# EAGLE design SNAC  7ch SMS 3D Dongle (EAGLE 9.0.1)
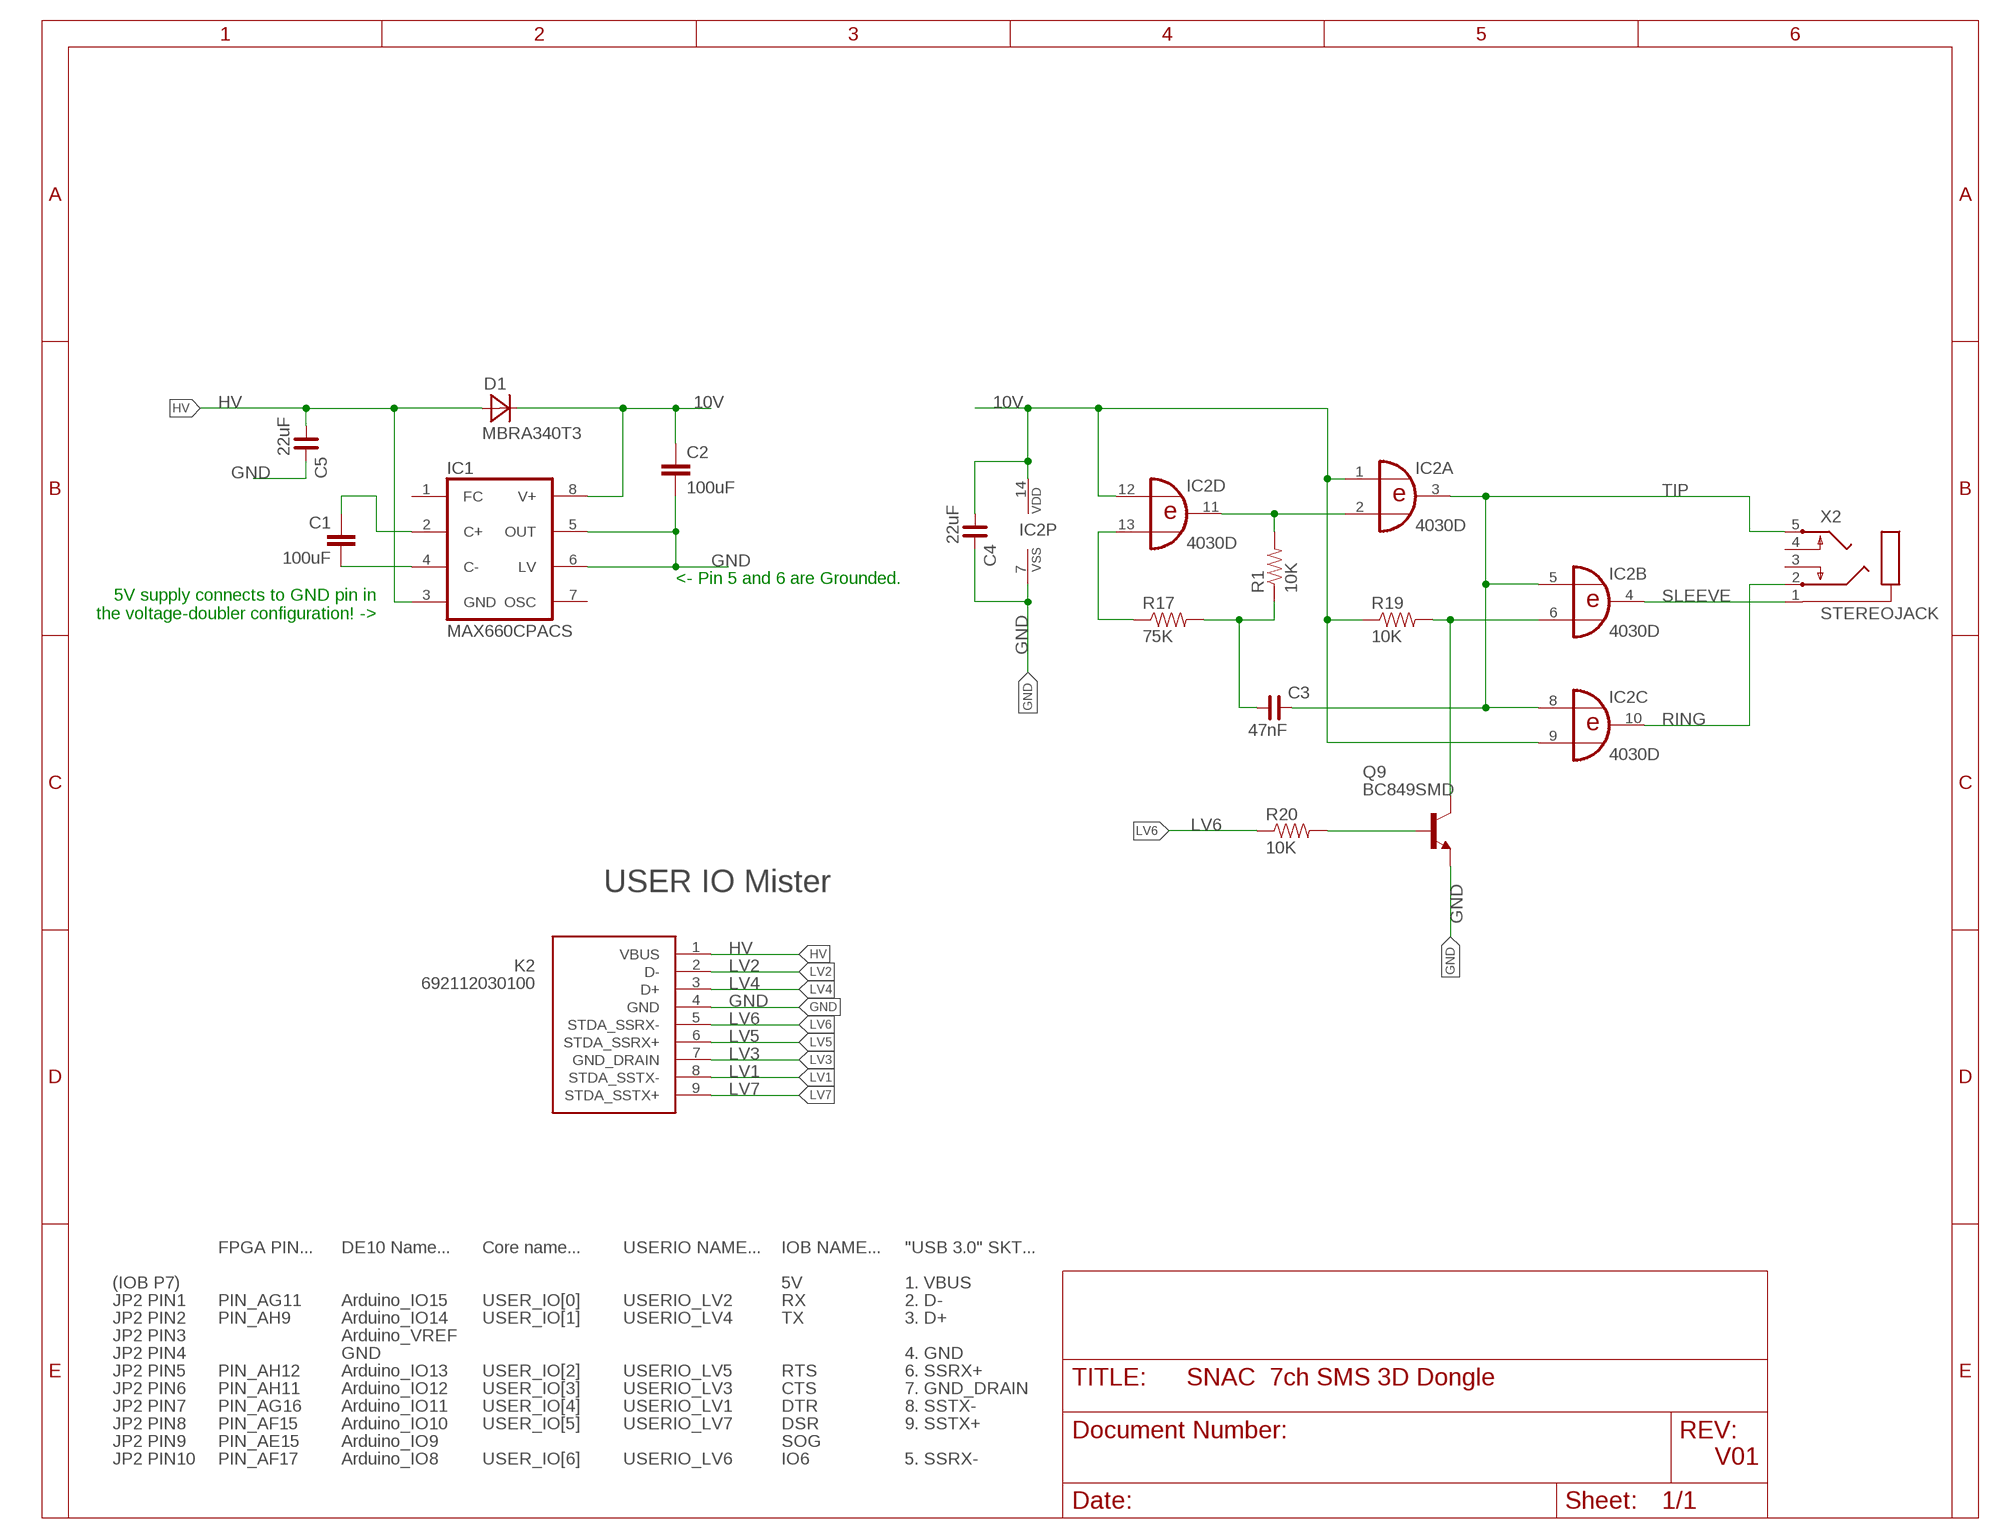
[diagram p0: schematic, sheet 1]

## Parts
C1  100uF  C-EUC1210  [C1210]
C2  100uF  C-EUC1210  [C1210]
C3  47nF  C_0805  [C0805]
C4  22uF  C_0805  [C0805]
C5  22uF  C_0805  [C0805]
D1  MBRA340T3  [SMA]
IC1  MAX660CPACS  [SO08]
IC2  4030D  [SO14]
K2  692112030100  [692112030100]
Q9  BC849SMD  [SOT23-BEC]
R1  10K  RESISTOR0603-RES  [0603-RES]
R17  75K  RESISTOR0603-RES  [0603-RES]
R19  10K  RESISTOR0603-RES  [0603-RES]
R20  10K  RESISTOR0603-RES  [0603-RES]
X2  STEREOJACK  [STX3100]

## Nets
10V: C2.1 C4.1 D1.C IC1.8(V+) IC2.1(A:I0) IC2.9(C:I1) IC2.12(D:I0) IC2.14(P:VDD) R19.1
GND: C2.2 C4.2 C5.2 IC1.5(OUT) IC1.6(LV) IC2.7(P:VSS) K2.4(GND) Q9.E
HV: C5.1 D1.A IC1.3(GND) K2.1(VBUS)
LV1: K2.8(STDA_SSTX-)
LV2: K2.2(D-)
LV3: K2.7(GND_DRAIN)
LV4: K2.3(D+)
LV5: K2.6(STDA_SSRX+)
LV6: K2.5(STDA_SSRX-) R20.1
LV7: K2.9(STDA_SSTX+)
N$5: C3.1 R1.1 R17.2
N$6: IC2.2(A:I1) IC2.11(D:O) R1.2
N$10: IC2.13(D:I1) R17.1
N$13: IC2.6(B:I1) Q9.C R19.2
N$14: Q9.B R20.2
N$25: C1.1 IC1.2(C+)
N$26: C1.2 IC1.4(C-)
RING: IC2.10(C:O) X2.2
SLEEVE: IC2.4(B:O) X2.1
TIP: C3.2 IC2.3(A:O) IC2.5(B:I0) IC2.8(C:I0) X2.5
Unconnected: IC1.1(FC) IC1.7(OSC) X2.3 X2.4

## Notes on the sheet
- <- Pin 5 and 6 are Grounded.
- 5V supply connects to GND pin in
  the voltage-doubler configuration! ->
- USER IO Mister
- FPGA PIN... | DE10 Name... | Core name... | USERIO NAME... | IOB NAME... | "USB 3.0" SKT...
- (IOB P7) | 5V | 1. VBUS
- JP2 PIN1 | PIN_AG11 | Arduino_IO15 | USER_IO[0] | USERIO_LV2 | RX | 2. D-
- JP2 PIN2 | PIN_AH9 | Arduino_IO14 | USER_IO[1] | USERIO_LV4 | TX | 3. D+
- JP2 PIN3 | Arduino_VREF
- JP2 PIN4 | GND | 4. GND
- JP2 PIN5 | PIN_AH12 | Arduino_IO13 | USER_IO[2] | USERIO_LV5 | RTS | 6. SSRX+
- JP2 PIN6 | PIN_AH11 | Arduino_IO12 | USER_IO[3] | USERIO_LV3 | CTS | 7. GND_DRAIN
- JP2 PIN7 | PIN_AG16 | Arduino_IO11 | USER_IO[4] | USERIO_LV1 | DTR | 8. SSTX-
- JP2 PIN8 | PIN_AF15 | Arduino_IO10 | USER_IO[5] | USERIO_LV7 | DSR | 9. SSTX+
- JP2 PIN9 | PIN_AE15 | Arduino_IO9 | SOG
- JP2 PIN10 | PIN_AF17 | Arduino_IO8 | USER_IO[6] | USERIO_LV6 | IO6 | 5. SSRX- | V01

## Library data of the parts
C1 C2 = rcl:C-EU: CAPACITOR, European symbol; SPICEPREFIX: C
C3-C5 = rc-master-smd:C_: NON-POLARIZED CAP
D1 = diode:MBRA340T3: Surface Mount Schottky Power Rectifier Source: http://www.onsemi.com/pub_link/Collateral/MBRA340T3-D.PDF
IC1 = maxim:MAX660CPA: Charge-pump VOLTAGE CONVERTER
IC2 = 40xx:4030: Quad XOR
K2 = Wuerth_Elektronik_eiCan_Communication_Connectors_STENCIL:692112030100: WR-COM USB 3.0 SMT PLUG WITH CLIPTYPE A
Q9 = transistor-npn:BC849*: NPN Transistor
R1 R17 R19 R20 = SparkFun:RESISTOR: Resistor Basic schematic elements and footprints for 0603, 1206, and PTH 1/10th watt (small) resistors.
X2 = adafruit:STEREOJACK: MIC/HEADPHONE JACK Stereo jack with two switches. Kycon STX3100, CUI SJ1-3555NG and/or 4UCon 05544

## Board
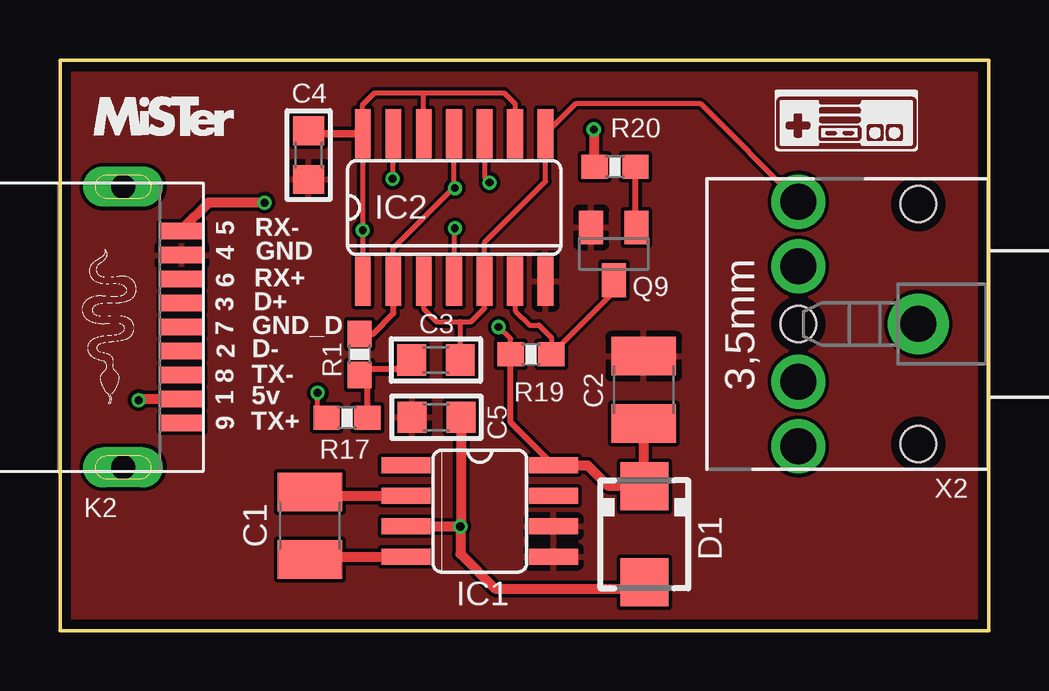
[diagram p1: board, top side]
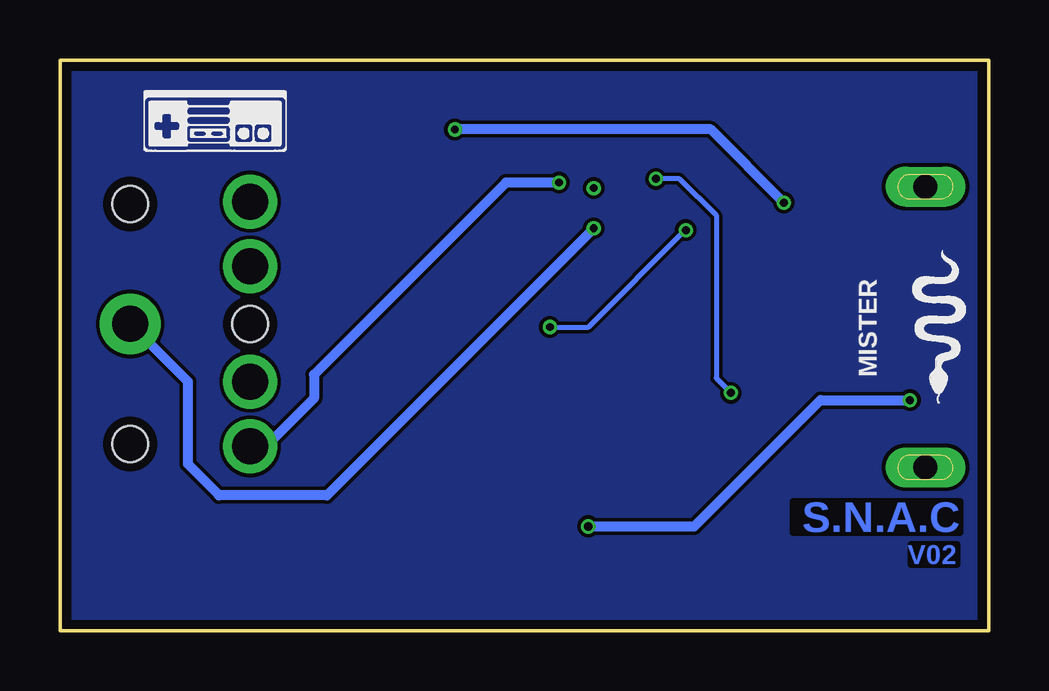
[diagram p2: board, bottom side, seen from below]

Size 38.71 x 23.77 mm. Coordinates in mm from the lower left corner, seen from the top.
Outline: 0,23.77 38.71,23.77 38.71,0 0,0 0,23.77
Copper layers (1*16): Top 0.035mm / dielectric 1.5mm / Bottom 0.035mm
Design rules "oshpark-2layer *": minimum track width 6mil, minimum drill 10mil, track to track 6mil, track to pad 6mil, pad to pad 6mil, via to via 6mil, smd to smd 6mil, copper to edge 15mil, drill to drill 6mil, minimum pad ring 5mil, minimum via ring 5mil, stop-mask expansion 2.5mil, vias tented up to drill 0mil, thermal gap 10mil

### Footprints (pad centres in the part's own frame; a part is rotated, then mirrored left to right if it is on the bottom)
C1210 = smd 1.6 x 2.7: 1 -1.4,0; 2 1.4,0
C0805 = smd 1.2 x 1.3: 1 -1.016,0; 2 1.016,0
SMA = smd 2 x 2: A 2,0; C -2,0
SO08 = smd 0.66 x 2.032: 1 -1.905,-3.073; 2 -0.635,-3.073; 3 0.635,-3.073; 4 1.905,-3.073; 5 1.905,3.073; 6 0.635,3.073; 7 -0.635,3.073; 8 -1.905,3.073
SO14 = smd 0.66 x 2.032: 1 -3.81,-3.073; 2 -2.54,-3.073; 3 -1.27,-3.073; 4 0,-3.073; 5 1.27,-3.073; 6 2.54,-3.073; 7 3.81,-3.073; 8 3.81,3.073; 9 2.54,3.073; 10 1.27,3.073; 11 0,3.073; 12 -1.27,3.073; 13 -2.54,3.073; 14 -3.81,3.073
692112030100 = smd 0.7 x 1.8: 1 -3,0; 2 -1,0; 3 1,0; 4 3,0; 5 4,0; 6 2,0; 7 0,0; 8 -2,0; 9 -4,0 | drill 1 pad 1.676 long: Z1 5.85,2.45; Z2 -5.85,2.45
SOT23-BEC = smd 1 x 1.4: B -0.95,-1.1; C 0,1.1; E 0.95,-1.1
0603-RES = smd 1.1 x 1: 1 -0.85,0; 2 0.85,0
STX3100 = drill 1.5 pad 2.54: 1 2.7,-0.1 | drill 1.5: 2 7.7,5; 3 7.7,2.3; 4 7.7,-2.5; 5 7.7,-5.2 | hole 1.5: 2.7,4.9; 2.7,-5.1; 7.7,-0.1

### Placement (x,y rotation side)
C1  10.41,4.37 270 top
C2  24.33,10.03 90 top
C3  15.67,11.28 0 top
C4  10.36,19.81 270 top
C5  15.7,8.89 180 top
D1  24.36,4.01 270 top
IC1  17.5,4.98 270 top
IC2  16.43,17.63 0 top
K2  5.08,12.65 90 top
Q9  23.09,15.7 180 top
R1  12.5,11.51 90 top
R17  11.96,8.86 0 top
R19  19.63,11.51 0 top
R20  23.14,19.33 0 top
X2  38.48,12.67 180 top

### Tracks (layer width: path | path; a pad name or v marks a point on that pad's centre or on a via)
10V  (via drill 0.33)
  Top 0.203: IC2.1 12.52,14.66 12.62,14.76 v12.62,16.69 IC2.14 12.62,21.92 13.11,22.4 15.16,22.4 | IC2.12 15.16,22.4 | 15.16,22.4 18.52,22.4 18.97,21.95 IC2.9 | R19.1 18.78,12.15 v18.29,12.65
  Top 0.254: IC1.8 18.78,8.67 R19.1
  Top 0.305: C4.1 10.49,20.7 IC2.14
  Top 0.406: C2.1 24.33,6.04 | 24.33,6.04 D1.C | IC1.8 22,6.88 22.84,6.04 24.33,6.04
  Bottom 0.203: v18.29,12.65 16.69,12.65 12.65,16.69 v12.62,16.69
GND
  Top 0.203: 22.14,16.45 Q9.E 22.16,16.97
  pour Top: 0,23.77 38.71,23.77 38.71,0 0,0
HV  (via drill 0.33, 0.35)
  Top 0.406: K2.1 3.32,9.65 v3.28,9.6 | IC1.3 v16.69,4.34 | C5.1 16.71,4.37 v16.69,4.34 | v16.69,4.34 16.69,3.2 18.14,1.75 24.1,1.75 D1.A
  Bottom 0.406: v16.69,4.34 12.27,4.34 7.01,9.6 v3.28,9.6
LV4
  Top 0.178: 5.08,13.67 K2.3
LV6  (via drill 0.33)
  Top 0.178: 5.08,16.71 K2.5
  Top 0.406: v8.53,17.83 6.2,17.83 5.08,16.71 | R20.1 22.29,20.84 v22.25,20.88
  Bottom 0.406: v8.53,17.83 11.58,20.88 v22.25,20.88
N$5
  Top 0.254: C3.1 14.27,10.9 12.74,10.9 R1.1 12.81,10.34 R17.2
N$6  (via drill 0.33)
  Top 0.203: 16.46,20.68 IC2.11 16.43,18.47 | v16.46,18.44 16.43,18.47 | IC2.2 13.89,15.93 16.43,18.47
  Top 0.254: IC2.2 13.89,13.21 13.04,12.36 R1.2
N$10  (via drill 0.33)
  Top 0.203: v13.87,18.82 13.89,18.85 IC2.13 | R17.1 10.74,9.23 v10.74,9.91
  Bottom 0.203: v13.87,18.82 12.88,18.82 11.35,17.3 11.35,10.52 v10.74,9.91
N$13
  Top 0.203: 18.97,13.64 IC2.6 18.97,13.33 19.58,12.73 19.96,12.73 20.48,12.21 R19.2 23.09,14.11 Q9.C
N$14
  Top 0.203: Q9.B 24.07,16.98
  Top 0.254: Q9.B 23.99,16.85 R20.2
N$15
  pour Bottom: 0,23.77 38.71,23.77 38.71,0 0,0
N$25
  Top 0.406: C1.1 11.12,5.61 IC1.2
N$26
  Top 0.406: C1.2 11.07,3.07 IC1.4
RING  (via drill 0.33)
  Top 0.203: IC2.10 17.7,18.87 v17.91,18.67
  Bottom 0.406: v17.91,18.67 20.12,18.67 28.12,10.67 28.12,9.68 30.12,7.67 X2.2
SLEEVE  (via drill 0.33)
  Top 0.203: v16.46,16.76 16.43,16.74 IC2.4
  Bottom 0.406: v16.46,16.76 27.58,5.64 32.08,5.64 33.38,6.93 33.38,10.37 X2.1
TIP
  Top 0.203: IC2.3 15.16,13.41 15.7,12.88 16.69,12.88 | 16.69,12.88 17.14,12.88 17.7,13.44 IC2.5 17.7,16.18 20.24,18.72 IC2.8 21.49,21.95 26.71,21.95 X2.5 | C3.2 16.69,12.88

### Text on the board
Bottom: S.N.A.C | V02
tPlace: 5 | RX- | 4 | GND | 6 | RX+ | 3 | D+ | 7 | GND_D | 2 | D- | 8 | TX- | 1 | 5v | 9 | TX+
bPlace: MISTER